# Altium schematic sheet INA2xx.SchDoc
size A4
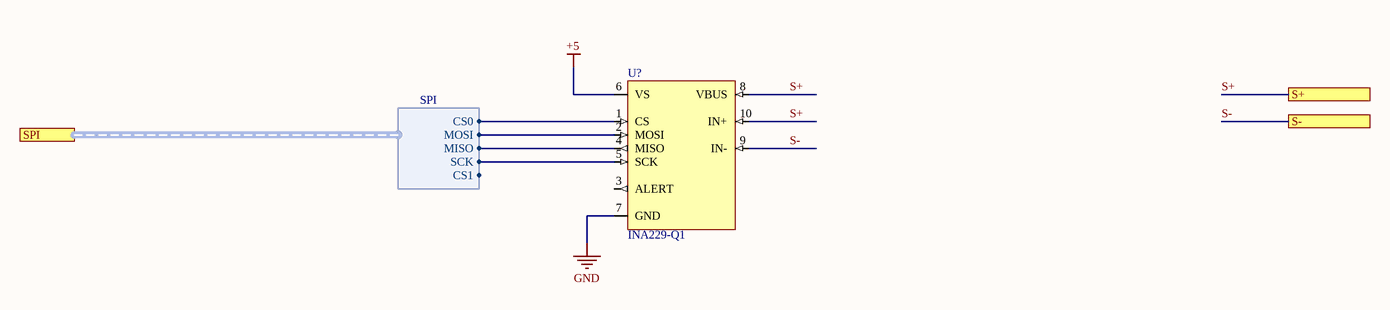
[diagram p0: INA2xx.SchDoc]

## Parts
U?  INA229-Q1  [VSSOP10]

## Ports
S+, S-, SPI (harness SPI)

## Harnesses
SPI: MOSI, MISO, SCK, CS0, CS1

## Nets
+5: U?.6(VS)
GND: U?.7(GND)
S+: U?.8(VBUS) U?.10(IN+) ; port S+
S-: U?.9(IN-) ; port S-
NetU?_1: U?.1(CS) ; port SPI.CS0
NetU?_2: U?.2(MOSI) ; port SPI.MOSI
NetU?_4: U?.4(MISO) ; port SPI.MISO
NetU?_5: U?.5(SCK) ; port SPI.SCK

Not connected (* = marked no-connect by the designer): U? 3(ALERT)

## Library data of the parts
U? = INA229: 85-V, 20-Bit, Ultra-Precise Power/Energy/Charge Monitor With SPI Interface; Manufacturer: Texas Instruments; Manufacturer Part Number: INA229AQDGSRQ1